# Altium project SB.PrjPcb
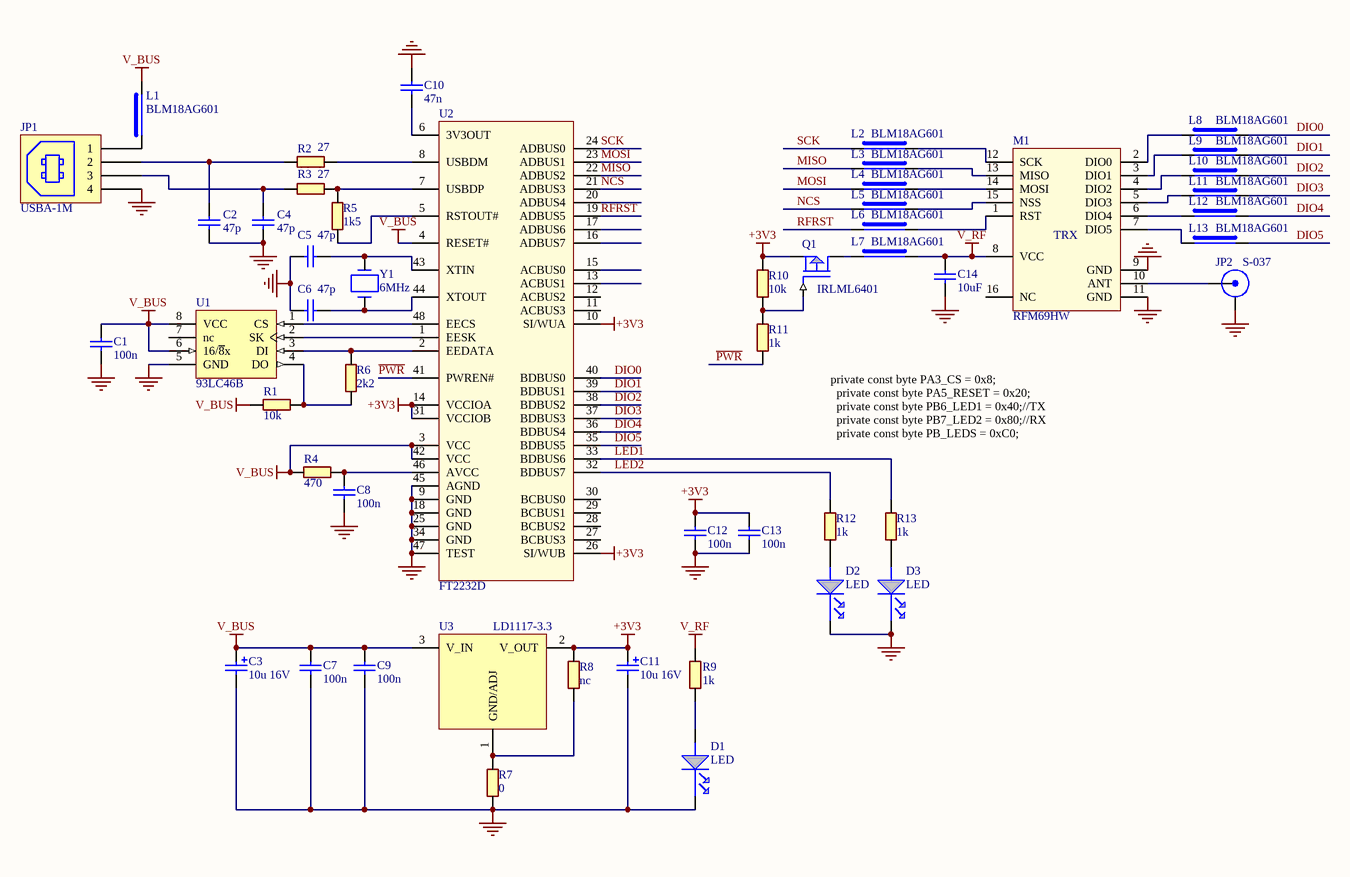
[diagram p0: SB2232_v02.SchDoc]
1 sheet, 51 parts. Net scope: global (net labels, ports and power ports of the same name join across sheets).
Board file: SB2232_v02.PcbDoc

## Sheet SB2232_v02.SchDoc
size 420 x 297 mm; DrawnBy: Рулько В.; DocumentNumber: RFM69_USBBOARD; SheetNumber: 1; SheetTotal: 1; Title1str: Модуль радіосканера; PageSetup: Record=PageOptions|CenterHorizontal=False|CenterVertical=False|PrintScale=0.95|XCorrection=0.00|YCorrection=0.00|PrintKind=1|BorderSize=5000000|LeftOffset=0|BottomOffset=0|Orientation=1|PaperLength=1000|PaperWidth=1000|Scale=100|PaperSource=15|PrintQuality=600|MediaType=1|DitherType=10|PaperKind=A4|PrintScaleMode=1; DocumentType1str: Схема електрична; DocumentType2str: принципова

### Parts
C1  100n  [CAPC1608X08N]
C2  47p  [CAPC1608X08N]
C3  10u 16V  [CAPMP3217X18N]
C4  47p  [CAPC1608X08N]
C5  47p  [CAPC1608X08N]
C6  47p  [CAPC1608X08N]
C7  100n  [CAPC1608X08N]
C8  100n  [CAPC1608X08N]
C9  100n  [CAPC1608X08N]
C10  47n  [CAPC1608X08N]
C11  10u 16V  [CAPMP3217X18N]
C12  100n  [CAPC1608X08N]
C13  100n  [CAPC1608X08N]
C14  10uF  [CAPC2012X11N]
D1  LED  [LEDC200X125X80L40N]
D2  LED  [LEDC200X125X80L40N]
D3  LED  [LEDC200X125X80L40N]
JP1  USBA-1M  [USB_A_M_SMD]
JP2  S-037  [S-037_3D]
L1  BLM18AG601  [INDC1608X10N]
L2  BLM18AG601  [INDC1608X10N]
L3  BLM18AG601  [INDC1608X10N]
L4  BLM18AG601  [INDC1608X10N]
L5  BLM18AG601  [INDC1608X10N]
L6  BLM18AG601  [INDC1608X10N]
L7  BLM18AG601  [INDC1608X10N]
L8  BLM18AG601  [INDC1608X10N]
L9  BLM18AG601  [INDC1608X10N]
L10  BLM18AG601  [INDC1608X10N]
L11  BLM18AG601  [INDC1608X10N]
L12  BLM18AG601  [INDC1608X10N]
L13  BLM18AG601  [INDC1608X10N]
M1  RFM69HW  [LGA16_RFM69]
Q1  IRLML6401  [SOT-23]
R1  10k  [RESC1608X06N]
R2  27  [RESC1608X06N]
R3  27  [RESC1608X06N]
R4  470  [RESC1608X06N]
R5  1k5  [RESC1608X06N]
R6  2k2  [RESC1608X06N]
R7  0  [RESC1608X06N]
R8  nc  [RESC1608X06N]
R9  1k  [RESC1608X06N]
R10  10k  [RESC1608X06N]
R11  1k  [RESC1608X06N]
R12  1k  [RESC1608X06N]
R13  1k  [RESC1608X06N]
U1  93LC46B  [SOIC127P600X175-8N]
U2  FT2232D  [TSQFP50P900X900X160-48N]
U3  LD1117-3.3  [SOT230P700X180-4N]
Y1  6MHz  [XTAL_HC49P488W45L1117T490H350]

### Nets
+3V3: C11.2 C12.1 C13.1 Q1.3(SOURCE) R8.2 R10.2 U2.10(SI/WUA) U2.14(VCCIOA) U2.26(SI/WUB) U2.31(VCCIOB) U3.2(V_OUT)
GND: C1.2 C2.2 C3.1 C4.2 C5.1 C6.1 C7.2 C8.2 C9.2 C10.1 C11.1 C12.2 C13.2 C14.2 D1.K(CATHODE) D2.K(CATHODE) D3.K(CATHODE) JP1.4 JP2.2(Y) M1.9(GND) M1.11(GND) R7.1 U1.5(GND) U2.9(GND) U2.18(GND) U2.25(GND) U2.34(GND) U2.45(AGND) U2.47(TEST)
V_BUS: C1.1 C3.2 C7.1 C9.1 L1.2 R1.2 R4.1 U1.6(16/~{8}x) U1.8(VCC) U2.3(VCC) U2.4(RESET#) U2.42(VCC) U3.3(V_IN)
V_RF: C14.1 L7.2 M1.8(VCC) R9.1
DIO0: L8.2 U2.40(BDBUS0)
DIO1: L9.2 U2.39(BDBUS1)
DIO2: L10.2 U2.38(BDBUS2)
DIO3: L11.2 U2.37(BDBUS3)
DIO4: L12.2 U2.36(BDBUS4)
DIO5: L13.2 U2.35(BDBUS5)
LED1: R13.2 U2.33(BDBUS6)
LED2: R12.1 U2.32(BDBUS7)
MISO: L3.1 U2.22(ADBUS2)
MOSI: L4.1 U2.23(ADBUS1)
NCS: L5.1 U2.21(ADBUS3)
~{PWR}: R11.1 U2.41(PWREN#)
RFRST: L6.1 U2.19(ADBUS5)
SCK: L2.1 U2.24(ADBUS0)
NetC2_1: C2.1 JP1.2 R2.1
NetC4_1: C4.1 JP1.3 R3.1
NetC5_2: C5.2 U2.43(XTIN) Y1.2
NetC6_2: C6.2 U2.44(XTOUT) Y1.1
NetC8_1: C8.1 R4.2 U2.46(AVCC)
NetC10_2: C10.2 U2.6(3V3OUT)
NetD1_A: D1.A(ANODE) R9.2
NetD2_A: D2.A(ANODE) R12.2
NetD3_A: D3.A(ANODE) R13.1
NetJP1_1: JP1.1 L1.1
NetJP2_1: JP2.1(X) M1.10(ANT)
NetL2_2: L2.2 M1.12(SCK)
NetL3_2: L3.2 M1.13(MISO)
NetL4_2: L4.2 M1.14(MOSI)
NetL5_2: L5.2 M1.15(NSS)
NetL6_2: L6.2 M1.1(RST)
NetL7_1: L7.1 Q1.2(DRAIN)
NetL8_1: L8.1 M1.2(DIO0)
NetL9_1: L9.1 M1.3(DIO1)
NetL10_1: L10.1 M1.4(DIO2)
NetL11_1: L11.1 M1.5(DIO3)
NetL12_1: L12.1 M1.6(DIO4)
NetL13_1: L13.1 M1.7(DIO5)
NetQ1_1: Q1.1(GATE) R10.1 R11.2
NetR1_1: R1.1 R6.1 U1.4(DO)
NetR2_2: R2.2 U2.8(USBDM)
NetR3_2: R3.2 R5.2 U2.7(USBDP)
NetR5_1: R5.1 U2.5(RSTOUT#)
NetR6_2: R6.2 U1.3(DI) U2.2(EEDATA)
NetR7_2: R7.2 R8.1 U3.1(GND/ADJ)
NetU1_1: U1.1(CS) U2.48(EECS)
NetU1_2: U1.2(SK) U2.1(EESK)

Not connected (* = marked no-connect by the designer): M1 16(NC); U1 7(nc); U2 11(ACBUS3) 12(ACBUS2) 13(ACBUS1) 15(ACBUS0) 16(ADBUS7) 17(ADBUS6) 20(ADBUS4) 27(BCBUS3) 28(BCBUS2) 29(BCBUS1) 30(BCBUS0)

### Notes on the sheet
- private const byte PA3_CS = 0x8;
  private const byte PA5_RESET = 0x20;
  private const byte PB6_LED1 = 0x40;//TX
  private const byte PB7_LED2 = 0x80;//RX
  private const byte PB_LEDS = 0xC0;
- Перв. примен.
- Справ. №
- Подп. и дата
- Инв. № дубл.
- Взам. инв. №
- Изм.
- Лист
- № докум.
- Подп.
- Дата
- Лит.
- Масса
- Масштаб
- Т.контр.
- Пров.
- Разраб.
- Листов
- Инв. № подл.
- Н.контр.
- Утв.
- Копировал
- Формат А3
- (in symbol RFM69HW_V13_2) TRX

### Library data of the parts
C1 C2 C4-C10 C12-C14 = CAPN: Вид: Конденсатор; Корпус: =Footprint
  C1 C7-C9 C12 C13: Тип: 100n
  C2 C4-C6: Тип: 47p
  C10: Тип: 47n
  C14: Тип: 10uF
C3 C11 = CAPP: Вид: Конденсатор; Тип: 10u 16V; Корпус: =Footprint
JP1 = USB_conn: USB_connector; Вид: Роз'єм; Тип: USBA-1M; Корпус: =Footprint
JP2 = BNC: RF Connector; Вид: Роз'єм; Производитель: *; Допустимая замена: *; Цена: *; PDF файл: *; Температурный диапазон: *; Описание пользователя: *; Конфигурация контактов RxNN: *; *: *; Тип: S-037; Корпус: =Footprint
L1-L13 = SUPRESOR: Вид: Ferrite bead; Примечание: *; Производитель: *; Тип: BLM18AG601; Корпус: =Footprint
M1 = RFM69HW_V13_2: Тип: RFM69HW; Корпус: =Footprint
Q1 = MOSF-P: Вид: Транзистор; Тип: IRLML6401; Корпус: =Footprint
R1-R13 = RES: Вид: Резистор; Корпус: =Footprint
  R1 R10: Тип: 10k
  R2 R3: Тип: 27
  R4: Тип: 470
  R5: Тип: 1k5
  R6: Тип: 2k2
  R7: Тип: 0
  R8: Тип: nc
  R9 R11-R13: Тип: 1k
U1 = 93C56: 3-wire EEPROM; Вид: Мікросхема; Производитель: *; Допустимая замена: *; Цена: *; PDF файл: *; Температурный диапазон: *; Тип: 93LC46B; Корпус: =Footprint
U2 = FT2232D: Вид: Мікросхема; Тип: FT2232D; Корпус: =Footprint
U3 = LM1117_3.3: Вид: Мікросхема; Тип: LD1117-3.3; Корпус: =Footprint
Y1 = Y: Вид: Кварц; Производитель: *; CrossRef: *; Цена: *; PDF: *; T-range: *; Тип: 6MHz; Корпус: =Footprint